# Altium schematic sheet Mechanical.SchDoc
size A4
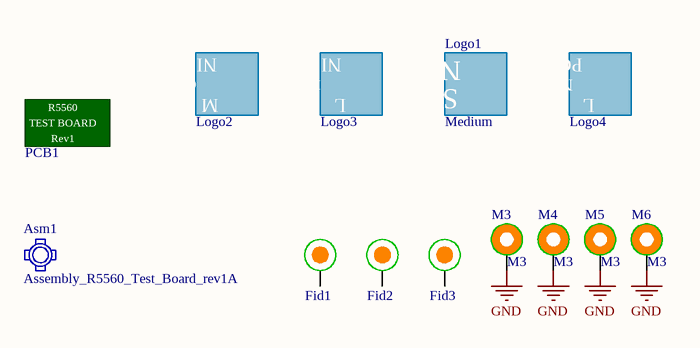
[diagram p0: Mechanical.SchDoc]

## Parts
Asm1  Assembly_R5560_Test_Board_rev1A  (mechanical)
Fid1  PCB_Fiducial_Round_1mm  [PCB_Fiducial_Round_1mm]  (value not drawn)
Fid2  PCB_Fiducial_Round_1mm  [PCB_Fiducial_Round_1mm]  (value not drawn)
Fid3  PCB_Fiducial_Round_1mm  [PCB_Fiducial_Round_1mm]  (value not drawn)
Logo1  Medium  [NI_SN_MEDIUM]
Logo2  NI_COMPLETE_M_LOGO  [NI_COMPLETE_M_LOGO]  (value not drawn)
Logo3  (no value)  [NI_ProjectName_L_Serigraphy]
Logo4  PCB_Number_L  [NI_PCB_Number_L_Serigraphy]  (value not drawn)
M3  M3  [PCBPad_M3_Head6mm]
M4  M3  [PCBPad_M3_Head6mm]
M5  M3  [PCBPad_M3_Head6mm]
M6  M3  [PCBPad_M3_Head6mm]
PCB1  PCB_R5560_Test_Board_rev1  (value not drawn)  (mechanical)

## Nets
GND: M3.1 M4.1 M5.1 M6.1

Not connected (* = marked no-connect by the designer): Fid1 1; Fid2 1; Fid3 1

## Notes on the sheet
- Project Name:
- Revision:
- File Name:
- Date:
- Nuclear Instruments srl
- Via Lecco, 16, Lambrugo, Italy
- +39 031 2289570
- info@nuclearinstruments.eu
- http://www.nuclearinstruments.eu
- (in symbol NI_COMPLETE_M_LOGO) NI; Complete; M
- (in symbol NI_PCB_Number_L_Serigraphy) PCB; Number; L
- (in symbol NI_ProjectName_L_Serigraphy) NI; Proj Name; L
- (in symbol NI_SN_MEDIUM) NI; SN
- (in symbol PCB_R5560_Test_Board_rev1) R5560; TEST BOARD; Rev1

## Library data of the parts
Asm1 = Assembly_R5560_Test_Board_rev1A: NICode: 02960002888; NIClass: AssemblyJob
Fid1-Fid3 = PCB_Fiducial_Round_1mm: NICode: 01250000389; NIClass: Fiducial
Logo1 = NI_SN_MEDIUM: NICode: 03230002376; NIClass: ProjectSN
Logo2 = NI_COMPLETE_M_LOGO: NICode: 03230002372; NIClass: Logo
Logo3 = NI_ProjectName_L_Serigraphy: NICode: 03230002445; NIClass: ProjectName
Logo4 = NI_PCB_Number_L_Serigraphy: NICode: 03230002907; NIClass: PCBNumber
M3-M6 = PCBPad_M3_Head6mm: NICode: 01250000388; NIClass: PCBPad
PCB1 = PCB_R5560_Test_Board_rev1: NICode: 01840002887; NIClass: PCB